# Altium schematic sheet RP5_Battery_Flex.SchDoc
size A4; SheetNumber: 1; SheetTotal: 1; ENG_APP_DATE: --/--/--; DSN_APP_DATE: --/--/--; CHK_APP_DATE: --/--/--
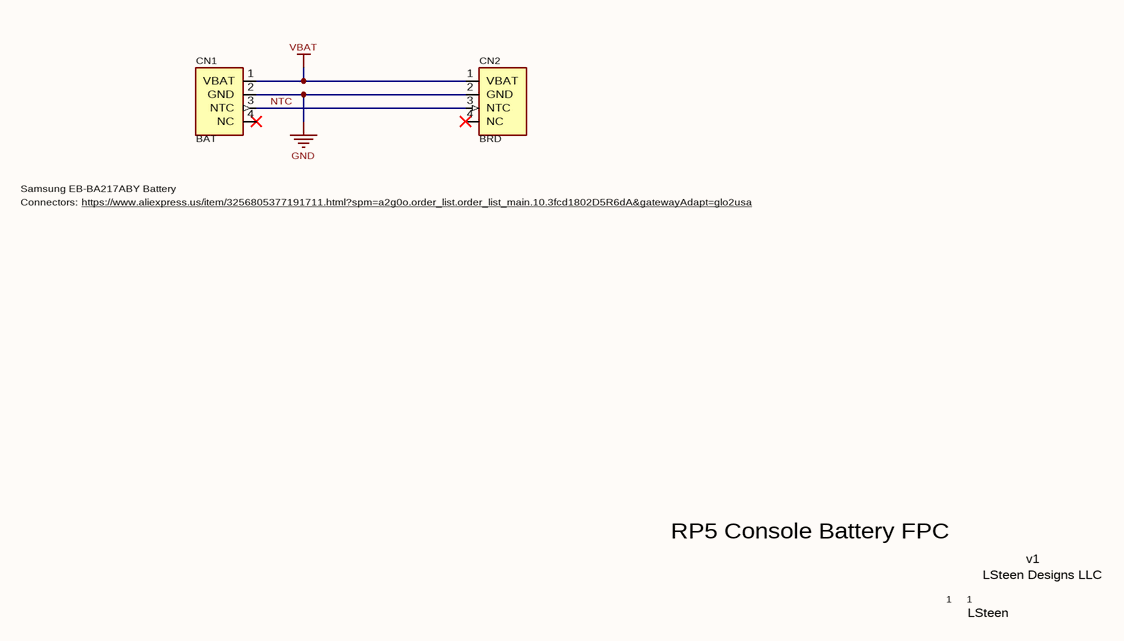
[diagram p0: RP5_Battery_Flex.SchDoc]

## Parts
CN1  BAT  [BAT_SS_EB-BA217ABY]
CN2  BRD  [BAT_SS_EB-BA217ABY_FLEX_CN]

## Nets
GND: CN1.2(GND) CN2.2(GND)
VBAT: CN1.1(VBAT) CN2.1(VBAT)
NTC: CN1.3(NTC) CN2.3(NTC)

Not connected (* = marked no-connect by the designer): CN1 4(NC)*; CN2 4(NC)*

## Notes on the sheet
- Samsung EB-BA217ABY Battery
- Connectors:
- https://www.aliexpress.us/item/3256805377191711.html?spm=a2g0o.order_list.order_list_main.10.3fcd1802D5R6dA&gatewayAdapt=glo2usa
- RP5 Console Battery FPC
- 1
- LSteen Designs LLC
- v1
- LSteen
- DWG. NO.
- REV.
- SHT.
- THIS DOCUMENT AND THE DATA DISCLOSED HEREIN OR HEREWITH IS THE PROPERTY OF ALTIUM LIMITED AND MAY BE FREELY DISTRIBUTED IN WHOLE. NO RIGHTS ARE RESERVED OR EXPRESS OR IMPLIED WARANTEE GIVEN.
- REVISION
- DESCRIPTION
- DATE
- APPROVED
- ENG:
- APPROVALS
- PROJECT
- DSN:
- CHK:
- REFERENCE DOCUMENTS
- PROJECT REVISION:
- TITLE
- DOCUMENT REVISION:
- DESIGN ITEM:
- BOM:
- FAB DWG:
- PCB DWG:
- ASSY DWG:
- SCALE:
- SIZE
- B
- CAGE CODE
- FILE NAME
- DWG NO.
- SHEET
- OF
- REV

## Library data of the parts
CN1 = BAT_SS_EB-BA217ABY: Samsung battery connector
CN2 = BAT_SS_EB-BA217ABY_FLEX_CN: Samsung battery connector; System: Connector